# EasyEDA Pro project remo-v0.8.0-rc2-a.epro, board PCB5_6
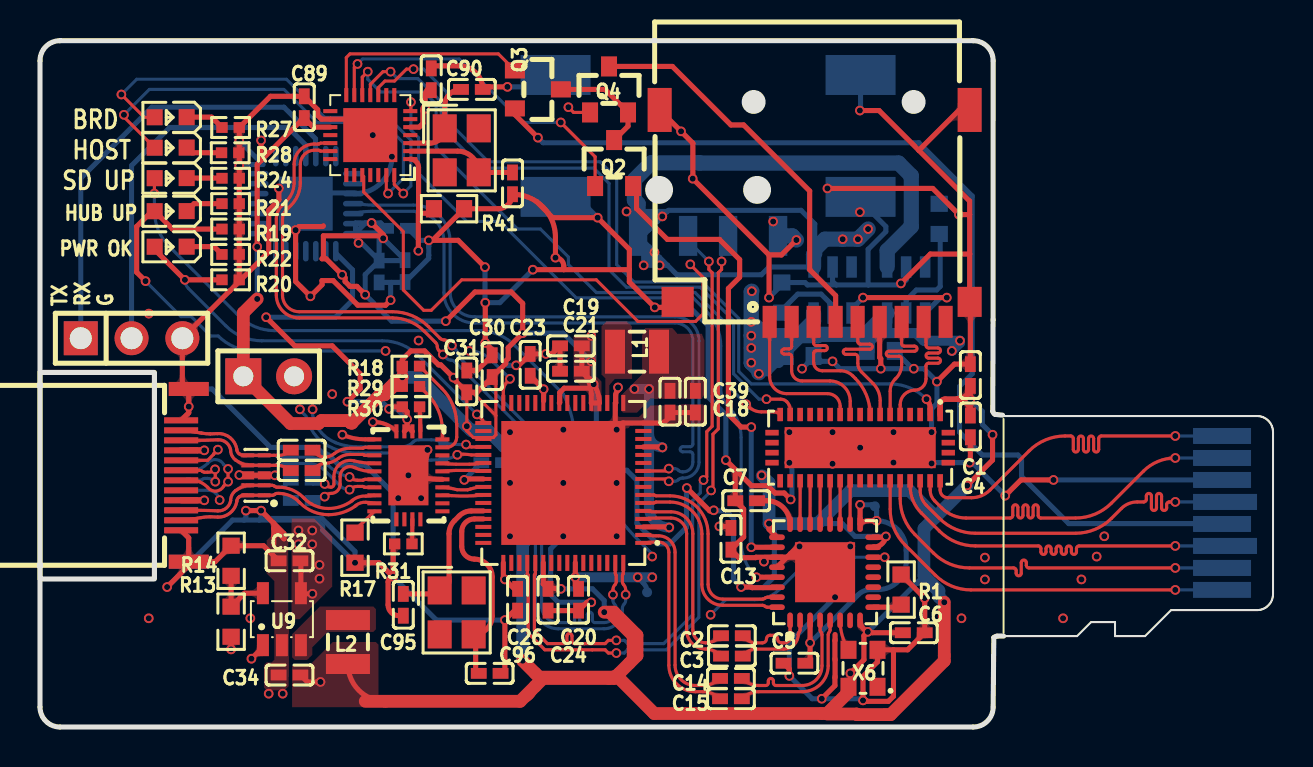
[diagram p3: board, top side]
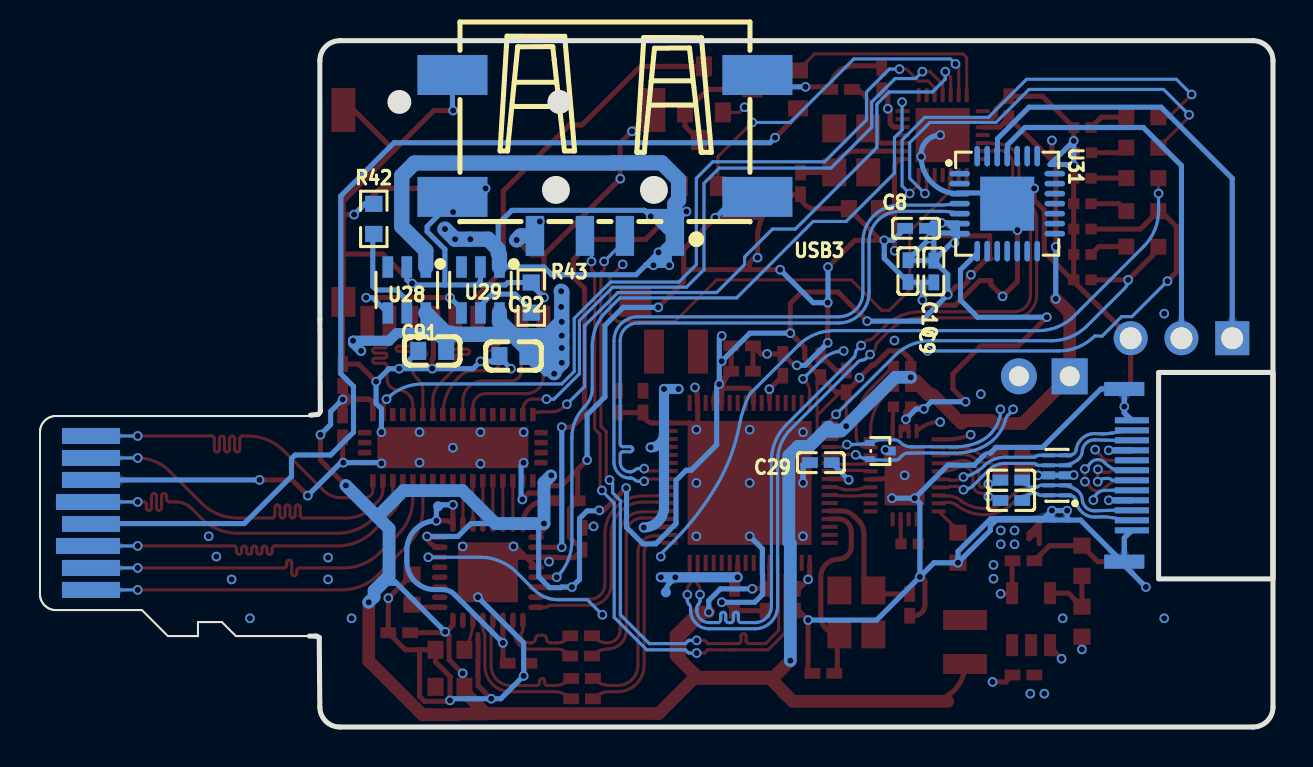
[diagram p4: board, bottom side, seen from below]

Outline 61.66 x 34.33 mm; copper layers: Top Layer, Inner1, Inner2, Bottom Layer. Coordinates in mm from the lower left corner of the outline.
Outline path: rectangle 0,17.74 5.72,7.41 ; 48.13,15.6 47.76,15.64 arc(47.68,15.71) 47.64,15.8 47.66,20.37 47.66,33.33 arc(47.37,34.04) 46.66,34.33 1,34.33 arc(0.29,34.04) 0,33.33 0,1 arc(0.29,0.29) 1,0 46.66,0 arc(47.37,0.29) 47.66,1 47.69,4.47 arc(47.78,4.53) 47.88,4.55 48.18,4.55
Stack: Top Layer 0.035mm 外层铜厚1oz / Dielectric1 0.2104mm 7628 RC49% 8.6mil / Inner1 0.0152mm 内层铜厚 / Dielectric2 1.065mm 1.1mm H/HOZ Copper / Inner2 0.0152mm 内层铜厚 / Dielectric3 0.2104mm 7628 RC49% 8.6mil / Bottom Layer 0.035mm 外层铜厚1oz

## Design rules (mm)
net $1N466: DP1
net RD_TX+: RD_TX
net $1N465: DP1
net RD_TX-: RD_TX
net RD_RX+: RD_RX
net RD_RX-: RD_RX
net UP_D-: UP_D
net UP_D+: UP_D
net UP_RX-: UP_RX
net UP_RX+: UP_RX
net UP_TX+: UP_TX
net UP_TX-: UP_TX
net $1N16323: DP4
net $1N16329: DP4
net UP_TX2-: UP_TX2
net UP_RX2+: UP_RX2
net UP_TX2+: UP_TX2
net UP_RX2-: UP_RX2
net UP_TX1+: UP_TX1
net $2N1220: DP5
net UP_TX1-: UP_TX1
net $2N1225: DP5
net $2N1216: DP6
net UP_RX1-: UP_RX1
net UP_RX1+: UP_RX1
net RD_D+: DP7
net SER_D+: SER_D
net SER_D-: SER_D
net HS_D+: DP9
net $2N4733: DP6
net RD_D-: DP7
net HS_D-: DP9
net BRD_D-: DP10
net BRD_D+: DP10
template: 自定义配置
spacing copperThickness1oz (default): track to track 0.102, other pairs 0.152 to 0.3
spacing copperThickness2oz: track to track 0.203, other pairs 0.152 to 0.3
track width copperThickness1oz (default): min 0.127, default 0.254, max 2.54
track width copperThickness2oz: min 0.203, default 0.254, max 2.54
track width TFP: min 0.157, default 0.157, max 0.157
differential pair differentialPair (default): width min 0.127, default 0.157, max 2.54; gap min 0.152, default 0.152
differential pair differentialPair3.0: width min 0.127, default 0.157, max 2.54; gap min 0.152, default 0.152
differential pair differentialPair4: width min 0.127, default 0.157, max 2.54; gap min 0.152, default 0.152
via viaSize (default): diameter min 0.483, default 0.483, max 10; hole min 0.3, default 0.305, max 6.299
net TS_DAT1 uses MUX_DUT, TFP
net TS_CLK uses MUX_DUT, TFP
net TS_DAT0 uses MUX_DUT, TFP
net TS_DAT3 uses MUX_DUT, TFP
net TS_DAT2 uses MUX_DUT, TFP
net TS_CMD uses MUX_DUT, TFP
net TF_DAT1 uses TFP, TF_MUX
net TF_DAT0 uses TFP, TF_MUX
net TF_CLK uses TFP, TF_MUX
net TF_CMD uses TFP, TF_MUX
net TF_DAT3 uses TFP, TF_MUX
net TF_DAT2 uses TFP, TF_MUX
net UP_DAT2 uses MUX_TS, TFP
net UP_DAT3 uses MUX_TS, TFP
net UP_CMD uses MUX_TS, TFP
net UP_CLK uses MUX_TS, TFP
net UP_DAT0 uses MUX_TS, TFP
net UP_DAT1 uses MUX_TS, TFP
diff pair DP1 uses differentialPair3.0
diff pair RD_TX uses differentialPair3.0
diff pair RD_RX uses differentialPair3.0
diff pair UP_D uses differentialPair4
diff pair UP_RX uses differentialPair3.0
diff pair UP_TX uses differentialPair3.0
diff pair DP4 uses differentialPair3.0

## Placement (name value [footprint] x y rotation side)
C1  100nF  [C0402]  46.52 15.04 90 top
C2  100nF  [C0402]  34.6 4.56 0 top
C3  100nF  [C0402]  34.6 3.55 0 top
C4  100nF  [C0402]  46.52 17.61 270 top
C5  100nF  [C0402]  37.72 3.19 0 top
C6  100nF  [C0402]  43.69 4.72 0 top
C7  100nF  [C0402]  35.31 11.32 180 top
C8  100nF  [C0402]  17.85 24.94 0 bottom
C9  100nF  [C0402]  18.25 22.81 90 bottom
C10  100nF  [C0402]  16.96 22.79 90 bottom
C13  100nF  [C0402]  34.55 9.42 270 top
C14  100nF  [C0402]  34.55 2.43 180 top
C15  100nF  [C0402]  34.55 1.41 180 top
C18  100nF  [C0402]  32.77 16.27 270 top
C19  10uF  [C0402]  26.55 17.8 0 top
C20  100nF  [C0402]  26.93 6.37 270 top
C21  100nF  [C0402]  26.55 19.07 0 top
C23  100nF  [C0402]  24.51 18.12 270 top
C24  100nF  [C0402]  25.41 6.37 270 top
C26  100nF  [C0402]  23.88 6.37 90 top
C29  100nF  [C0402]  22.61 13.22 180 bottom
C30  100nF  [C0402]  22.61 18.05 270 top
C31  100nF  [C0402]  21.34 17.29 270 top
C32  10uF  [C0402]  12.48 8.32 0 top
C34  10uF  [C0402]  12.48 2.6 180 top
C35  100nF  [C0402]  13.08 12.83 180 top
C36  100nF  [C0402]  13.08 13.85 180 top
C37  100nF  [C0402]  13.09 11.33 180 bottom
C38  100nF  [C0402]  13.09 12.35 180 bottom
C39  10uF  [C0402]  31.5 16.27 270 top
C89  0.1u  [C0402]  13.21 31 270 top
C90  0.1u  [C0402]  19.56 32.4 90 top
C91  10uF  [C0603]  42.04 18.81 0 bottom
C92  10uF  [C0603]  37.98 18.56 0 bottom
C93  20pF  [C0402]  21.6 31.89 180 top
C94  20pF  [C0402]  23.63 27.19 90 top
C95  20pF  [C0402]  18.17 6.11 90 top
C96  20pF  [C0402]  22.49 2.68 180 top
CARD1  TF PUSH  [TF-SMD_TF-PUSH]  38.74 25.57 180 top
H2  -  [HDR-TH_3P-P2.54-V-M]  4.58 19.45 0 top
H3  -  [HDR-TH_2P-P2.54-V-M-1]  11.44 17.54 0 top
L1  2.2uH  [IND-SMD_L2.5-W2.0_MHCHL2520]  29.85 18.78 0 top
L2  2.2uH  [IND-SMD_L2.5-W2.0_MHCHL2520]  15.4 4.25 90 top
LED5  -  [LED_0603]  6.48 30.5 180 top
LED6  -  [LED_0603]  6.48 28.97 180 top
LED7  -  [LED_0603]  6.48 25.8 180 top
LED8  -  [LED_0603]  6.48 24.02 180 top
LED9  -  [LED_0603]  6.48 27.45 180 top
Q2  AO3401A  [SOT-23_L2.9-W1.3-P1.90-LS2.4-BR]  28.71 28.21 270 top
Q3  AO3401A  [SOT-23_L2.9-W1.3-P1.90-LS2.4-BR]  24.9 31.89 180 top
Q4  AO3401A  [SOT-23_L2.9-W1.3-P1.90-LS2.4-BR]  28.45 31.89 270 top
R1  680  [R0603]  43.06 6.88 270 top
R13  68K  [R0603]  9.56 5.27 90 top
R14  15K  [R0603]  9.56 8.32 90 top
R17  20.5K  [R0603]  15.75 8.97 270 top
R18  10K  [R0402]  18.55 18.05 0 top
R19  10K  [R0402]  9.53 24.91 180 top
R20  10K  [R0402]  9.53 22.37 180 top
R21  1K  [R0402]  9.53 26.18 180 top
R22  1K  [R0402]  9.53 23.64 180 top
R24  1K  [R0402]  9.53 27.45 0 top
R27  1K  [R0402]  9.53 29.99 0 top
R28  1K  [R0402]  9.51 28.73 0 top
R29  10K  [R0402]  18.55 17.03 0 top
R30  10K  [R0402]  18.55 16.02 0 top
R31  10K  [R0402]  18.17 9.16 180 top
R41  10K  [R0603]  20.45 25.92 0 top
R42  22K  [R0603]  44.96 25.42 270 bottom
R43  22K  [R0603]  37.09 21.48 270 bottom
TP1  -  [Test-Point-0.5mm]  41.75 11.04 0 top
TP2  -  [Test-Point-0.5mm]  30.36 6.74 90 top
U1  TF卡插头  [TF卡封装]  59.18 10.71 180 top
U2  TS3DV642A0RUAR  [WFQFN-42_L9.0-W3.5-P0.50-BL-EP]  41.01 13.97 180 top
U3  GL3224-OIY04  [HQFN-32_L5.0-W5.0-P0.50-BL-EP3.0]  39.26 7.74 0 top
U6  CH634W6G  [QFN-64_L8.0-W8.0-P0.40-TL-EP6.2]  26.17 12.21 180 top
U7  TPD4EUSB30DQAR-N  [DFN-10_L2.5-W1.0-P0.50-BL-A]  10.8 12.59 90 bottom
U8  TPD2EUSB30DRTR-N  [SOT-723_L1.2-W0.8-P0.40-LS1.2-BR]  19.64 13.8 0 bottom
U9  TLV62569DBVR  [SOT-23-5_L3.0-W1.7-P0.95-LS2.8-BR]  12.1 5.39 270 top
U10  TPD4EUSB30DQAR-N  [DFN-10_L2.5-W1.0-P0.50-BL-A]  10.8 12.59 90 top
U11  VL160  [MQFN-28_L4.5-W3.5-P0.40-BL-EP]  18.42 12.59 270 top
U27  CH32V203G6U6  [QFN-28_L4.0-W4.0-P0.40-BL-EP2.7]  16.52 29.61 90 top
U28  CH217K  [SOT-23-6_L2.9-W1.6-P0.95-LS2.8-BL]  43.31 21.86 0 bottom
U29  CH217K  [SOT-23-6_L2.9-W1.6-P0.95-LS2.8-BL]  39.63 21.86 0 bottom
U31  CH9102X  [TQFN-28_L5.0-W5.0-P0.50-BL-EP2.7]  13.29 26.18 270 bottom
USB1  MC-233J08H93  [USB-C-SMD_TYPE-C-31-M-20]  7.25 12.59 270 top
USB3  10.0 QTJ6.3  [USB-A-SMD_10.0-QTJ6.3]  33.41 28.59 0 bottom
X6  25MHz  [OSC-SMD_4P-L2.5-W2.0-BL-1]  41.15 2.94 90 top
X7  24MHz  [CRYSTAL-SMD_4P-L3.2-W2.5-BL]  21.09 28.85 270 top
X8  24MHz  [CRYSTAL-SMD_4P-L3.2-W2.5-BL]  20.83 5.73 270 top

## Footprints (pads in the part's own frame, mm; a bottom-side part is the same pattern mirrored in y, then rotated)
C0402
  rect 0.79x0.54 smd: 1(-0.545,0) 2(0.545,0)
C0603
  rect 0.8x0.9 smd: 1(-0.7,0) 2(0.7,0)
CRYSTAL-SMD_4P-L3.2-W2.5-BL
  rect 1.4x1.2 smd: 1(-1.1,-0.85) 2(1.1,-0.85) 3(1.1,0.85) 4(-1.1,0.85)
DFN-10_L2.5-W1.0-P0.50-BL-A
  rect 0.2x0.633 smd: 1(-1,-0.411) 2(-0.5,-0.411) 4(0.5,-0.411) 5(1,-0.411) 6(1,0.411) 7(0.5,0.411) 9(-0.5,0.411) 10(-1,0.411)
  rect 0.4x0.633 smd: 3(0,-0.411) 8(0,0.411)
HDR-TH_2P-P2.54-V-M-1
  rect 1.8x1.8 hole 1: 1(-1.27,0)
  round 1.8 hole 1: 2(1.27,0)
HDR-TH_3P-P2.54-V-M
  rect 1.7x1.7 hole 1.1: 1(-2.54,0)
  round 1.7 hole 1.1: 2(0,0) 3(2.54,0)
HQFN-32_L5.0-W5.0-P0.50-BL-EP3.0
  oval 0.28x0.785 smd: 1(-1.75,-2.408) 2(-1.25,-2.408) 3(-0.75,-2.408) 4(-0.25,-2.408) 5(0.25,-2.408) 6(0.75,-2.408) 7(1.25,-2.408) 8(1.75,-2.408) 17(1.75,2.408) 18(1.25,2.408) 19(0.75,2.408) 20(0.25,2.408) 21(-0.25,2.408) 22(-0.75,2.408) 23(-1.25,2.408) 24(-1.75,2.408)
  oval 0.785x0.28 smd: 9(2.408,-1.75) 10(2.408,-1.25) 11(2.408,-0.75) 12(2.408,-0.25) 13(2.408,0.25) 14(2.408,0.75) 15(2.408,1.25) 16(2.408,1.75) 25(-2.408,1.75) 26(-2.408,1.25) 27(-2.408,0.75) 28(-2.408,0.25) 29(-2.408,-0.25) 30(-2.408,-0.75) 31(-2.408,-1.25) 32(-2.408,-1.75)
  rect 3x3 smd: 33(0,0)
IND-SMD_L2.5-W2.0_MHCHL2520
  rect 1x2.2 smd: 1(-1.1,0) 2(1.1,0)
LED_0603
  rect 0.8x0.8 smd: 1(-0.851,-0.01) 2(0.75,-0.005)
MQFN-28_L4.5-W3.5-P0.40-BL-EP
  rect 0.2x0.7 smd: 1(-1.8,-1.7) 2(-1.4,-1.7) 3(-1,-1.7) 4(-0.6,-1.7) 5(-0.2,-1.7) 6(0.2,-1.7) 7(0.6,-1.7) 8(1,-1.7) 9(1.4,-1.7) 10(1.8,-1.7) 15(1.8,1.7) 16(1.4,1.7) 17(1,1.7) 18(0.6,1.7) 19(0.2,1.7) 20(-0.2,1.7) 21(-0.6,1.7) 22(-1,1.7) 23(-1.4,1.7) 24(-1.8,1.7)
  rect 0.7x0.2 smd: 11(2.2,-0.6) 12(2.2,-0.2) 13(2.2,0.2) 14(2.2,0.6) 25(-2.2,0.6) 26(-2.2,0.2) 27(-2.2,-0.2) 28(-2.2,-0.6)
  rect 3x2 smd: 29(0,0)
OSC-SMD_4P-L2.5-W2.0-BL-1
  rect 0.9x0.8 smd: 1(-0.925,-0.725) 2(0.925,-0.725) 3(0.925,0.725) 4(-0.925,0.725)
QFN-28_L4.0-W4.0-P0.40-BL-EP2.7
  rect 0.2x0.7 smd: 1(-1.2,-2) 2(-0.8,-2) 3(-0.4,-2) 4(-0.001,-2) 5(0.4,-2) 6(0.8,-2) 7(1.2,-2) 15(1.2,2) 16(0.8,2) 17(0.4,2) 18(0,2) 19(-0.4,2) 20(-0.8,2) 21(-1.2,2)
  rect 0.7x0.2 smd: 8(2,-1.2) 9(2,-0.8) 10(2,-0.4) 11(1.999,0) 12(2,0.4) 13(2,0.8) 14(2,1.2) 22(-2,1.2) 23(-2,0.8) 24(-2,0.4) 25(-2,0) 26(-2,-0.4) 27(-2,-0.8) 28(-2,-1.2)
  rect 2.7x2.7 smd: 29(0.001,0)
QFN-64_L8.0-W8.0-P0.40-TL-EP6.2
  rect 0.8x0.2 smd: 1(-4,3) 2(-4,2.6) 3(-4,2.2) 4(-4,1.8) 5(-4,1.4) 6(-4,1) 7(-4,0.6) 8(-4,0.2) 9(-4,-0.2) 10(-4,-0.6) 11(-4,-1) 12(-4,-1.4) 13(-4,-1.8) 14(-4,-2.2) 15(-4,-2.6) 16(-4,-3) 33(4,-3) 34(4,-2.6) 35(4,-2.2) 36(4,-1.8) 37(4,-1.4) 38(4,-1) 39(4,-0.6) 40(4,-0.2) 41(4,0.2) 42(4,0.6) 43(4,1) 44(4,1.4) 45(4,1.8) 46(4,2.2) 47(4,2.6) 48(4,3)
  rect 0.2x0.8 smd: 17(-3,-4) 18(-2.6,-4) 19(-2.2,-4) 20(-1.8,-4) 21(-1.4,-4) 22(-1,-4) 23(-0.6,-4) 24(-0.2,-4) 25(0.2,-4) 26(0.6,-4) 27(1,-4) 28(1.4,-4) 29(1.8,-4) 30(2.2,-4) 31(2.6,-4) 32(3,-4) 49(3,4) 50(2.6,4) 51(2.2,4) 52(1.8,4) 53(1.4,4) 54(1,4) 55(0.6,4) 56(0.2,4) 57(-0.2,4) 58(-0.6,4) 59(-1,4) 60(-1.4,4) 61(-1.8,4) 62(-2.2,4) 63(-2.6,4) 64(-3,4)
  rect 6.2x6.2 smd: 65(0,0)
R0402
  rect 0.566x0.54 smd: 1(-0.433,0) 2(0.433,0)
R0603
  rect 0.806x0.864 smd: 1(-0.753,0) 2(0.753,0)
SOT-23-5_L3.0-W1.7-P0.95-LS2.8-BR
  rect 1.1x0.6 smd: 1(1.3,-0.95) 2(1.3,0) 3(1.3,0.95) 4(-1.3,0.95) 5(-1.3,-0.95)
SOT-23-6_L2.9-W1.6-P0.95-LS2.8-BL
  rect 0.532x1.072 smd: 1(-0.95,-1.149) 2(0,-1.149) 3(0.95,-1.149) 4(0.95,1.149) 5(0,1.149) 6(-0.95,1.149)
SOT-23_L2.9-W1.3-P1.90-LS2.4-BR
  rect 1x0.8 smd: 1(1.15,-0.95) 2(1.15,0.95) 3(-1.15,0)
SOT-723_L1.2-W0.8-P0.40-LS1.2-BR
  rect 0.489x0.294 smd: 1(0.529,-0.4) 2(0.529,0.4)
  rect 0.489x0.434 smd: 3(-0.529,0)
Test-Point-0.5mm
  round 0.5 smd far side: 1(0,0)
TF-SMD_TF-PUSH
  rect 0.7x1.6 smd: 1(2.25,5.3) 2(1.15,5.3) 3(0.05,5.3) 4(-1.05,5.3) 5(-2.15,5.3) 6(-3.25,5.3) 7(-4.35,5.3) 8(-5.45,5.3) CD(-6.55,5.3)
  rect 1.2x1.5 smd: 10(-7.75,4.3)
  rect 1.2x2.2 smd: 11(-7.75,-5.3) 12(7.75,-5.3)
  rect 1.6x1.5 smd: 13(6.85,4.3)
TF卡封装
  rect 2.9x0.8 smd far side: 1(0.075,3.85) 2(0.074,2.751) 4(0.075,0.551) 6(0.074,-1.651) 7(0.074,-2.751) 8(0.074,-3.85)
  rect 3.2x0.8 smd far side: 3(-0.074,1.65) 5(-0.075,-0.551)
TQFN-28_L5.0-W5.0-P0.50-BL-EP2.7
  oval 0.28x1.03 smd: 1(-1.5,-2.377) 2(-1,-2.377) 3(-0.5,-2.377) 4(0,-2.377) 5(0.5,-2.377) 6(1,-2.377) 7(1.5,-2.377) 15(1.5,2.377) 16(1,2.377) 17(0.5,2.377) 18(0,2.377) 19(-0.5,2.377) 20(-1,2.377) 21(-1.5,2.377)
  oval 1.03x0.28 smd: 8(2.377,-1.5) 9(2.377,-1) 10(2.377,-0.5) 11(2.377,0) 12(2.377,0.5) 13(2.377,1) 14(2.377,1.5) 22(-2.377,1.5) 23(-2.377,1) 24(-2.377,0.5) 25(-2.377,0) 26(-2.377,-0.5) 27(-2.377,-1) 28(-2.377,-1.5)
  rect 2.7x2.7 smd: 29(0,0)
USB-A-SMD_10.0-QTJ6.3
  rect 0.92x2 smd: 1(-3.5,4.025) 2(-1,4.025) 3(1,4.025) 4(3.5,4.025)
  rect 3.5x2 smd: 5(7.625,2.075) 6(7.625,-4.025) 7(-7.625,-4.025) 8(-7.625,2.075)
USB-C-SMD_TYPE-C-31-M-20
  rect 0.7x2 smd: 25(-4.32,0.192) 25(4.32,0.192)
  rect 0.7x2 smd far side: 25(-4.32,0.192) 25(4.32,0.192)
  rect 0.3x1.7 smd: A1(-2.75,-0.188) A2(-2.25,-0.188) A3(-1.75,-0.188) A4(-1.25,-0.188) A5(-0.75,-0.188) A6(-0.25,-0.188) A7(0.25,-0.188) A8(0.75,-0.188) A9(1.25,-0.188) A10(1.75,-0.188) A11(2.25,-0.188) A12(2.75,-0.188)
  rect 0.3x1.7 smd far side: B1(2.75,-0.188) B2(2.25,-0.188) B3(1.75,-0.188) B4(1.25,-0.188) B5(0.75,-0.188) B6(0.25,-0.188) B7(-0.254,-0.192) B8(-0.75,-0.188) B9(-1.25,-0.188) B10(-1.75,-0.188) B11(-2.25,-0.188) B12(-2.75,-0.188)
WFQFN-42_L9.0-W3.5-P0.50-BL-EP
  rect 0.28x0.665 smd: 1(-3.998,-1.657) 2(-3.498,-1.657) 3(-2.998,-1.657) 4(-2.498,-1.657) 5(-1.998,-1.657) 6(-1.498,-1.657) 7(-0.998,-1.657) 8(-0.497,-1.657) 9(0.003,-1.657) 10(0.502,-1.657) 11(1.002,-1.657) 12(1.502,-1.657) 13(2.002,-1.657) 14(2.502,-1.657) 15(3.002,-1.657) 16(3.502,-1.657) 17(4.003,-1.657) 22(4.003,1.657) 23(3.502,1.657) 24(3.002,1.657) 25(2.502,1.657) 26(2.002,1.657) 27(1.502,1.657) 28(1.002,1.657) 29(0.502,1.657) 30(0.003,1.657) 31(-0.497,1.657) 32(-0.998,1.657) 33(-1.498,1.657) 34(-1.998,1.657) 35(-2.498,1.657) 36(-2.998,1.657) 37(-3.498,1.657) 38(-3.998,1.657)
  rect 0.665x0.28 smd: 18(4.41,-0.75) 19(4.41,-0.25) 20(4.41,0.25) 21(4.41,0.75) 39(-4.405,0.75) 40(-4.405,0.25) 41(-4.405,-0.25) 42(-4.405,-0.75)
  rect 7.55x2.05 smd: 43(0.003,0)

## Nets
As in the schematic.

Pads without a net: CARD1 CD; U2 3 4 9 12 13 14 15 18 19 20 21 22 23 30 31 32 39 40 41 42; U3 7; U6 8 11 12 14 15 22 23 24 26 28 29 30 31 34 43 46 47 48 50 51 55 56 57 59 60 61 62; U11 11 12 14 15 16 22; U27 4 6 15 18 21 22 23 25 26; U28 3; U29 3; U31 1 2 9 10 11 12 13 14 15 16 17 18 19 20 21 22 23 24 27 28; USB1 A8 B8; X6 1; X7 2 4; X8 2 4

## Via types
v1: diameter 0.482, hole 0.305, Top Layer to Bottom Layer, 239 vias

## Routing (per net, layer and track width the routed paths; a pad name or vN(x,y) marks a point on that pad's centre or on a via; arc(x,y) is an arc through that point)
+5V: length 136.9
  Top Layer w0.254: 18.36,15.05 18.36,14.93 U11.27 ; 18.36,15.05 U11.26 ; 18.36,15.05 v1(18.36,15.39) 18.36,15.78 R30.1 17.56,16.02 v1(17.45,15.91) ; v1(13.62,6.67) 13.08,6.67 U9.4 13.05,8.29 C32.2 ; v1(11.31,20.5) 12.74,19.07 14.61,19.07 16.01,17.67 16.01,16.91 v1(15.37,16.27) ; U9.1 11.15,3.99 v1(10.57,3.42)
  Top Layer w0.305: USB1.A9 v1(8.21,11.34) ; USB1.A4 v1(8.21,13.84)
  Inner2 w0.254: 8.01,12.97 8.21,13.18 v1(8.21,13.84) ; v1(10.57,3.42) 13.62,6.47 v1(13.62,6.67)
  Inner2 w0.508: 14.71,19.42 14.44,19.7 9.91,19.7 8.39,18.18 8.39,16.15 8.9,15.64 9.4,15.64 9.8,15.24 14.34,15.24 v1(15.37,16.27) 17.09,16.27
  Inner2 w0.762: 8.9,15.64 7.5,14.24 7.5,13.73 ; v1(35.6,21.8) v1(35.6,21.02) 35.6,18.25 v1(35.57,18.22) ; 18.09,15.66 v1(18.36,15.39) ; v1(17.45,15.91) 17.84,15.91
  Inner2 w1.524: 15.37,20.08 14.71,19.42 14.3,19 14.3,18.6 15.77,17.13 ; 15.37,20.08 15.63,19.83 15.63,17.8 ; 15.37,20.08 18.04,20.08 20.34,22.38 20.34,22.73 21.77,24.16 22.73,24.16 23.49,23.4 23.49,22.4 24.16,21.72 27.7,21.72 30.23,19.19 34.59,19.19 v1(35.57,18.22) ; v1(13.61,9.14) 14.81,9.14 16.63,10.96 16.63,13.61 17.8,14.78 17.8,15.27 17.91,15.38 ; 18.09,15.66 17.84,15.91 16.62,17.13 15.77,17.13 ; 15.77,17.13 15.77,16.17 15.68,16.09
  Bottom Layer w0.254: v1(11.31,20.5) 14.77,20.5 15.63,21.35 15.63,22.87 14.78,23.72 ; v1(35.95,17.67) 36.39,17.67 36.94,18.22 ; v1(15.37,16.27) 17.09,16.27 v1(17.45,15.91) 17.84,15.91 v1(18.36,15.39)
  Bottom Layer w0.305: USB1.A9 v1(8.21,11.34) ; USB1.A4 v1(8.21,13.84)
  Bottom Layer w0.508: v1(35.57,18.22) 36.5,18.22 ; 36.5,18.22 v1(35.95,17.67) ; 36.5,18.22 36.84,18.56 ; 36.5,18.22 36.94,18.22 C92.1 ; 41.9,19.7 41.35,19.7 ; 41.9,19.7 42.27,19.7 ; 41.9,19.7 41.34,19.14 ; v1(45.6,18.81) 46,19.22 v1(46,19.32) 44.2,19.32 43.82,19.7 42.27,19.7 ; 42.27,19.7 42.36,19.79 U28.6
  Bottom Layer w0.762: 37.27,18.56 36.58,18.56 ; 37.27,18.56 36.26,19.58 ; 37.27,18.56 C92.1 ; 36.26,19.58 37.96,19.58 ; 36.26,19.58 v1(35.57,20.27) ; 36.26,19.58 v1(35.57,19.58) ; 37.96,19.58 38.1,19.71 ; 37.96,19.58 38.87,19.58 38.94,19.64 ; 37.96,19.58 37.28,18.89 37.28,18.69 ; v1(35.57,18.22) v1(35.57,18.96) v1(35.57,19.58) ; v1(35.57,18.22) 35.6,18.25 35.9,18.56 36.58,18.56 ; v1(35.57,18.22) 35.95,17.84 35.95,17.72 ; v1(35.6,21.8) 35.57,21.77 v1(35.57,20.27) ; 38.1,19.71 38.68,20.29 U29.6 ; 38.1,19.71 38.16,19.64 38.94,19.64 ; v1(35.57,20.27) v1(35.57,19.58) ; v1(35.57,19.58) 36.58,18.56 ; C91.1 41.34,19.69 ; 41.34,19.69 41.12,19.69 41.07,19.64 38.94,19.64 ; 41.34,19.69 41.35,19.7 U28.6
  vias: v1(12.92,9.83) v1(12.92,9.14) v1(13.61,9.83) v1(13.98,8.11) v1(13.98,7.42)
GND: length 360.1
  Top Layer w0.254: 11.69,10.19 v1(11.06,10.82) v1(10.29,10.82) ; 11.69,10.19 12.2,9.68 12.2,9.42 11.9,9.72 ; 11.69,10.19 11.69,9.92 ; v1(17.66,7.51) 16.95,8.22 v1(15.75,8.22) ; v1(17.66,7.51) 17.66,9.09 R31.2 ; v1(17.66,7.51) arc(17.48,7.44) 17.41,7.26 17.41,6.11 arc(17.56,5.73) 17.95,5.57 C95.1 ; v1(6.36,7) 7.44,8.08 USB1.25 ; 34.77,12.88 C7.2 35.19,10.9 35.19,9.5 C13.2 34.95,8.47 35.78,8.47 35.8,8.49 U3.27 37.35,8.49 ; 34.77,12.88 v1(34.3,13.35) ; 34.77,12.88 35.58,12.07 36.39,12.07 36.76,11.7 37.21,11.7 v1(37.54,11.38) ; 46.49,25.65 46.49,26.31 43.95,28.85 ; 46.49,25.65 46.47,25.63 v1(45.95,25.63) 44.64,26.94 v1(39.38,26.94) ; 46.49,25.65 46.49,23.66 ; 11.69,9.55 11.69,9.92 ; 11.69,9.55 11.73,9.55 11.9,9.72 ; 11.69,9.55 11.69,9.16 ; 11.69,9.92 11.9,9.72 ; v1(48.27,11.57) 49.05,12.36 v1(50.68,12.36) ; R20.1 R22.1 R19.1 R21.1 R24.2 v1(9.96,28.08) v1(9.96,29.32) R27.2 11.52,31.55 C89.1 13.89,30.88 13.89,30.59 14.07,30.41 U27.16 15.72,30.41 arc(16.28,30.17) 16.52,29.61 ; R20.1 10.04,22.37 11.44,23.77 11.44,25.85 11.94,26.36 v1(11.94,26.94) ; R20.1 9.96,22.29 9.5,21.82 9.49,21.82 H2.3 7.12,17.23 USB1.25 v1(7.44,16.03) 7.44,15.72 USB1.A1 ; 36.45,23.61 37.08,23.61 v1(37.82,24.36) ; 36.45,23.61 v1(36.45,21.48) ; 36.45,23.61 v1(32.64,27.43) ; C24.2 C20.2 27.35,6.24 v1(27.56,6.24) ; 29.47,22.88 29.47,22.26 v1(30.74,20.99) 31.61,20.99 CARD1.13 ; 29.47,22.88 26.19,22.88 ; 29.47,22.88 29.47,23.89 v1(27.88,25.48) 25.64,25.48 25.4,25.71 ; 37.35,8.49 37.53,8.67 ; 37.35,8.49 U3.28 ; 37.35,8.49 38.51,8.49 ; 37.53,8.67 38.33,8.67 38.51,8.49 ; 37.53,8.67 37.89,9.03 v1(37.98,9.03) ; 39.76,4.63 39.76,4.38 arc(39.75,4.35) 39.75,4.31 39.75,3.41 arc(39.75,3.38) 39.76,3.35 39.76,2.53 arc(39.75,2.5) 39.75,2.46 39.75,2.07 v1(39.09,1.41) ; 43.95,28.85 45.97,30.87 CARD1.11 ; 43.95,28.85 41.96,30.84 v1(41,30.84) ; C19.1 C21.1 25.6,18.66 v1(25.3,18.66) C23.1 23.94,18.09 v1(23.81,18.09) ; USB1.A12 7.44,9.46 USB1.25 ; 19.56,33.07 20.96,33.07 arc(21.8,32.73) C93.1 22.27,32.02 v1(23.37,32.02) ; USB1.25 8.76,8.27 R14.2 11.18,9.07 C32.1 ; v1(46.49,13.22) 46.52,13.26 C1.1 ; 26.19,22.88 v1(24.64,22.88) ; 26.19,22.88 26.19,23.06 arc(26.07,23.36) v1(25.77,23.48) 25.77,24.5 arc(25.68,25.14) 25.4,25.71 ; 25.4,25.71 24.84,26.28 ; 25.4,25.71 arc(25.15,26.02) 24.84,26.28 ; 24.84,26.28 arc(24.26,26.55) 23.63,26.65 arc(23.42,26.14) 22.9,25.92 R41.2 19.63,24.34 ; CARD1.6 41.99,18.49 42.04,18.43 v1(42.04,17.92) ; v1(11.75,12.59) U10.3 U10.8 ; CARD1.12 v1(32.06,29.8) 32.65,29.21 32.65,27.45 ; 46.49,23.66 CARD1.10 46.52,21.23 C4.1 45.73,18.15 v1(44.85,17.28) ; 46.49,23.66 44.52,23.66 v1(43.05,22.19) ; 19.63,24.34 v1(19.44,24.34) ; 19.63,24.34 20.91,24.34 v1(22.25,23) ; 38.51,8.49 U3.33 ; v1(22.27,21.23) v1(22.27,19.22) 22.61,18.87 C30.1 21.85,17.83 C31.1 ; v1(37.47,2.56) 37.47,2.9 C5.1 ; 14.17,25.07 14.13,25.04 12.96,25.04 v1(12.78,24.86) 12.78,22.28 v1(13.52,21.54) 14.1,22.12 14.1,22.33 14.66,22.33 15.89,21.1 17.28,21.1 v1(17.53,21.35) ; 42.69,3.86 X6.2 41.88,3.26 41.13,2.51 41.15,2.48 v1(41.15,1.33) 41.32,1.33 41.36,1.28 42.42,1.28 42.68,1.54 42.68,3.85 42.69,3.86 ; 42.69,3.86 43.39,3.86 C6.2 v1(44.24,6.45) 43.06,7.63 ; v1(28.9,16.99) 28.9,16.84 28.86,16.8 arc(28.81,16.71) 28.79,16.61 28.79,16.21 arc(28.78,16.21) U6.18 28.77,14.94 arc(28.79,14.9) v1(28.84,14.88) arc(28.93,15.11) 29.17,15.21 U6.16 30.98,15.21 arc(31.35,15.36) C39.2 C18.2 ; 23.72,5.82 v1(23.25,5.35) 23.25,2.83 arc(23.23,2.75) 23.19,2.68 ; v1(19.38,13.86) arc(19.11,13.07) v1(18.42,12.59) arc(19.27,12.44) U11.19
  Inner1 w0.254: 10.29,11.14 10.29,12.28 v1(9.97,12.61) ; 10.29,11.14 v1(11.75,12.59) ; 10.29,11.14 v1(10.29,10.82) v1(11.06,10.82)
  Bottom Layer w0.152: 13.78,26.72 13.78,27.1
  Bottom Layer w0.158: 14.18,13.7 14.34,13.7 14.44,13.61
  Bottom Layer w0.254: v1(41,30.84) 41.03,30.87 USB3.6 ; 43.63,17.92 v1(42.04,17.92) 40,17.92 v1(39.63,18.29) 39.07,18.29 38.68,18.69 38.68,18.5 v1(38.11,17.92) ; 43.63,17.92 v1(43.69,17.92) 44.2,17.92 v1(44.85,17.28) 44.85,16.18 44.58,15.92 v1(44.58,14.75) ; 43.63,17.92 C91.2 ; v1(22.27,19.22) 23.39,18.09 v1(23.81,18.09) ; U31.3 15.75,26.68 arc(17.05,27.22) v1(17.6,28.53) 17.6,28.65 arc(17.32,29.33) v1(16.64,29.61) ; 14.44,13.61 14.95,13.1 16.26,13.1 v1(17.91,11.45) ; 10.97,10.35 11.06,10.44 v1(11.06,10.82) ; 10.97,10.35 10.2,10.35 ; 10.97,10.35 13.83,10.35 14.13,10.05 14.13,9.83 v1(15.75,8.22) ; v1(6.36,7) 7.44,8.08 USB1.25 ; U1.6 v1(50.68,12.36) ; v1(11.06,10.82) 11.45,10.43 14.1,10.43 15.75,8.78 v1(15.75,8.22) ; v1(11.06,10.82) v1(10.29,10.82) 10.29,10.45 10.2,10.35 ; 39.81,22.11 38.38,22.11 38.26,22.23 R43.1 37.09,22.12 v1(36.45,21.48) ; 39.81,22.11 41.41,22.11 ; 39.81,22.11 39.63,22.29 U29.2 ; v1(17.66,7.51) 16.95,8.22 v1(15.75,8.22) ; v1(17.66,7.51) 19.82,5.35 v1(23.25,5.35) ; v1(17.66,7.51) 17.66,11.19 v1(17.91,11.45) ; U28.2 43.31,22.37 43.13,22.19 v1(43.05,22.19) 42.98,22.11 41.41,22.11 ; v1(45.95,25.63) 45.41,26.17 R42.1 ; v1(17.53,21.35) 17.53,22.21 17.56,22.24 ; 10.2,10.35 9.63,10.35 7.54,8.27 USB1.25 ; v1(48.27,11.57) 46.62,13.22 v1(46.49,13.22) 44.62,13.22 v1(44.58,13.19) ; v1(17.91,11.45) v1(19.06,11.45) ; v1(37.47,13.22) 37.6,13.09 37.6,11.32 ; v1(41,25.76) 41.57,25.76 42.3,25.04 42.3,24.78 41.41,23.89 41.41,22.11 ; v1(41.15,1.33) 41.07,1.41 v1(39.09,1.41) 38.61,1.41 v1(37.47,2.56) 37.47,4.21 v1(39.76,6.49) ; v1(27.88,25.48) 26.85,26.52 25.78,26.52 ; v1(22.25,23) 22.25,21.24 v1(22.27,21.23) 22.99,21.23 v1(24.64,22.88) ; USB1.25 7.44,9.46 USB1.A12 ; v1(27.56,6.24) 25.91,6.24 25.53,6.62 25.53,6.68 25.52,6.7 25.52,7.62 25.53,7.64 25.53,8.91 v1(26.17,9.54) ; 17.56,22.24 18.24,22.24 C9.1 19.44,23.44 19.44,23.61 19.44,23.61 19.44,24.04 19.44,24.04 19.44,24.34 v1(19.44,24.34) 18.99,24.34 C8.2 ; 17.56,22.24 C10.1 ; v1(30.74,20.99) 32.5,20.99 33.41,20.08 33.41,16.51 34.3,15.62 v1(34.3,13.35) ; 13.28,26.22 13.78,26.72 15.78,26.72 ; U10.8 U10.3 v1(11.75,12.59) ; 25.78,32.62 25.19,32.02 v1(23.37,32.02) ; 14.18,13.7 14.13,13.7 13.85,13.99 11.53,13.99 8.6,16.91 USB1.25 v1(7.44,16.03) 7.44,15.72 USB1.A1 ; v1(23.5,12.21) 23.5,13.14 23.41,13.22 ; v1(9.96,29.32) 11.15,28.14 10.29,28.14 10.24,28.08 v1(9.96,28.08) v1(9.96,29.32)
  Bottom Layer w0.762: v1(37.82,24.36) 37.62,24.57 USB3.4
  vias: v1(5.44,20.68) v1(5.44,5.44) v1(10.52,5.44) v1(11.44,1.67) v1(12.14,1.67) v1(14.61,16.65) v1(18.93,19.33) v1(23.5,14.75) v1(23.5,9.54) v1(26.17,14.88) v1(26.17,12.21) v1(28.83,12.21) v1(28.84,9.54) v1(36.2,8.27) v1(36.66,25.29) v1(37.47,14.75) v1(39.63,14.75) v1(39.63,13.17) v1(40.52,9.03) v1(41.01,13.97) v1(42.68,14.75) v1(42.68,13.23) v1(46.08,5.44) v1(47.25,8.48) v1(47.25,7.38) v1(51.16,5.44) v1(52.08,7.38) v1(52.84,8.53) v1(53.22,9.54)
VCC: length 271.7
  Top Layer w0.152: 22.24,14.48 22.66,14.48 22.8,14.61 22.8,15.58 ; 22.24,14.48 22.1,14.48 ; 22.24,14.48 U6.35 22.1,14.48 ; 22.1,14.48 21.67,14.48 21.34,14.81 v1(21.34,15.05) C31.2 ; 22.8,15.58 21.63,16.74 ; 22.8,15.58 22.8,17.32 C30.2
  Top Layer w0.254: U3.25 36.46,9.89 v1(36.46,10.18) ; X6.4 40.52,2.1 v1(40.52,2.68) 41.2,3.36 41.2,4.57 v1(41.39,4.76) ; v1(47.63,14.62) 47.63,13.35 v1(46.36,12.08) ; v1(16.26,21.63) 15.85,22.04 15.5,22.04 15.26,22.29 15.26,22.47 v1(15.11,22.62) 14.31,23.42 14.1,23.42 14.17,23.49 14.17,24.57 17.03,24.57 v1(17.16,24.44) 17.16,24.63 v1(16.58,25.21) ; U3.30 36.83,6.97 35.6,6.97 35.57,7 v1(35.06,7) ; v1(20.29,20.3) 21.75,21.76 23.57,21.76 24.14,21.19 v1(24.14,19.7) 23.41,18.98 23.41,18.43 23.28,18.3 23.28,18.18 C30.2 21.85,16.74 C31.2 20.79,17.29 20.79,17.36 v1(20.68,17.48) 20.04,18.11 19.93,18.11 19.23,18.81 18.55,18.81 18.12,18.38 R18.1 ; C1.2 v1(46.52,16.39) ; U6.54 25.17,7.15 arc(25.59,6.96) v1(26.04,6.91) ; 11.06,28.34 10.86,28.14 v1(10.86,24.02) ; 11.06,28.34 13.18,30.46 C89.2 13.67,30.01 14.52,30.01 ; 11.06,28.34 v1(11.06,29.34) ; 29.47,3.19 29.47,4.49 v1(28.21,5.74) ; C19.2 27.46,17.43 arc(27.58,17.3) v1(27.69,17.15) arc(27.9,16.7) U6.20 U6.21 27.57,16.65 arc(27.56,16.8) 27.54,16.95 ; C19.2 C21.2 ; C19.2 arc(27.38,17.41) 27.54,16.95 ; 42.16,0.51 42.26,0.62 ; C6.1 41.63,4.72 arc(41.51,4.73) v1(41.39,4.76) ; 41.69,9.01 U3.15 arc(42.07,9.13) 42.29,9.49 ; 30.72,0.67 30.49,0.67 ; v1(46.52,16.39) 45.87,16.39 arc(45.86,16.39) 45.86,16.4 ; v1(46.52,16.39) C4.2 ; 39.09,0.67 39.07,0.65 ; R13.1 v1(9.56,3.88) ; 12.57,15.14 15.39,15.14 15.49,15.25 17.74,17.49 v1(18.12,17.49) ; v1(32.34,11.95) 33.49,10.81 33.66,10.81 ; U3.16 42.29,9.49 ; 42.29,9.49 42.3,9.49 ; 42.29,9.49 arc(42.29,9.51) v1(42.3,9.53) ; U6.25 25.99,16.23 25.99,16.72 26.21,16.95 27.54,16.95 ; 18.52,30.01 18.96,30.01 19.15,30.19 19.15,30.81 v1(19.26,30.93) 19.26,31.68 19.31,31.73 arc(19.38,31.91) 19.56,31.98 ; 28.96,2.68 24.77,2.68 24.77,2.05 arc(24.55,1.51) 24.01,1.29 ; C34.1 13.37,2.25 v1(14.02,2.25) ; v1(41.39,4.76) arc(41.11,4.99) U3.8 ; L2.1 arc(15.94,1.83) 17.26,1.29
  Top Layer w0.28: C1.2 46.52,15.74 arc(46.52,15.75) 46.52,15.76 arc(46.37,16.16) 46,16.39 arc(45.93,16.4) 45.86,16.4 ; 45.86,16.4 45.27,16.4 arc(45.09,16.33) 45.01,16.15 45.01,15.59 ; 45.86,16.4 arc(46.33,16.59) C4.2
  Top Layer w0.508: R18.1 v1(18.12,17.49) R29.1
  Top Layer w0.635: v1(18.12,17.49) 17.24,16.62 17,16.62 15.59,15.21 ; 25.15,2.43 25.03,2.43 v1(24.14,3.32) ; 25.15,2.43 28.45,2.43 ; 25.15,2.43 24.01,1.29 16.26,1.29 ; 39.36,0.65 40.83,0.65 40.86,0.62 42.53,0.62 45.22,3.31 v1(45.22,6.24) ; 15.59,15.21 15.53,15.21 15.41,15.33 14.08,15.33 13.93,15.18 12.53,15.18 H3.1 10.17,20.72 v1(10.86,21.41) ; 15.59,15.21 15.59,15.19 ; 28.84,2.56 30.72,0.67 39.36,0.67 40.43,1.75 X6.4 ; 28.84,2.56 28.71,2.43 28.45,2.43 ; 28.84,2.56 28.45,2.43 ; 28.84,2.56 29.85,3.57 29.85,4.59 28.69,5.74 v1(28.21,5.74)
  Inner2 w0.254: v1(14.02,2.25) 10.54,2.25 9.56,3.24 v1(9.56,3.88)
  Inner2 w0.635: v1(11.06,29.34) 11.06,29.35 12.07,30.37 18.7,30.37 v1(19.26,30.93)
  Bottom Layer w0.254: 15.78,24.71 16.89,24.71 16.96,24.65 ; 15.78,24.71 16.28,25.21 ; 15.78,24.71 15.78,25.21 16.28,25.21 ; 15.78,24.71 15.78,24.51 C10.2 ; C10.2 16.26,22.63 v1(16.26,21.63) 17.59,20.3 v1(20.29,20.3) ; C10.2 18.24,23.33 C9.2 v1(17.16,24.44) 16.98,24.62 ; C10.2 16.96,24.6 ; 16.28,25.21 v1(16.58,25.21) ; 44.79,10.51 44.62,10.68 ; 22.19,15.05 v1(21.34,15.05) ; 43.82,7.19 v1(41.39,4.76) ; 43.82,7.19 44.2,7.57 44.2,7.26 44.27,7.19 ; 43.82,7.19 44.27,7.19 ; v1(27.56,18.3) 26.16,19.7 v1(24.14,19.7) ; 16.96,24.6 16.96,24.65 ; 16.96,24.6 16.98,24.62 ; 16.96,24.65 16.98,24.62 ; 16.96,24.65 16.96,24.83 v1(16.58,25.21) ; 16.98,24.62 C8.1 17.03,25.21 v1(16.58,25.21) ; 44.27,7.19 44.95,6.51 ; v1(28.21,5.74) 28.21,6.33 27.63,6.91 v1(26.04,6.91) ; 22.43,14.81 21.58,14.81 21.79,14.6 22.63,14.6 ; v1(33.69,10.84) 33.72,10.81 34.3,10.81 34.68,10.43 34.68,7.38 v1(35.06,7) 35.57,7 35.6,6.97 36.17,6.97 36.72,7.52 36.72,9.91 v1(36.46,10.18) ; v1(42.3,9.53) 40.75,9.53 40.11,10.18 38.89,10.18 ; v1(32.34,11.95) 32.33,11.94 32.33,9.99 31.5,9.16 30.87,9.16 29.85,10.18 29.85,12.34 29.34,12.84 29.09,12.84 27.82,14.11 27.82,17.02 v1(27.69,17.15) 27.69,19.44 v1(27.56,19.57) ; v1(46.52,16.39) 47.12,15.79 47.12,15.13 v1(47.63,14.62) ; 23.37,13.86 23.2,14.04 ; v1(10.86,21.41) v1(10.86,24.02)
  Bottom Layer w0.635: v1(45.22,6.24) 44.95,6.51 44.95,6.82 44.2,7.57 44.2,9.92 v1(46.36,12.08) ; 36.11,12.56 36.46,12.22 v1(36.46,10.18) 38.89,10.18 40.54,11.83 43.47,11.83 44.62,10.68 ; 22.23,15.01 23.2,14.04 23.74,14.04 24.21,13.57 24.21,9.25 24.14,9.17 v1(24.14,3.32) ; 21.58,14.81 v1(21.34,15.05) 18.9,17.49 v1(18.12,17.49)
  vias: v1(15.93,24.22) v1(36.09,12.59)
25CLKIN: length 1.6
  Top Layer w0.158: U3.6 arc(40.12,4.57) X6.3
BOOT0: length 14.9
  Top Layer w0.254: 18.93,25.7 18.92,25.69 v1(18.92,23.82) ; 18.93,25.7 19.47,25.7 R41.1 19.44,25.92 ; 18.93,25.7 18.93,28 arc(18.81,28.29) U27.1
  Inner1 w0.254: H3.2 12.91,17.54 16.78,21.41 16.78,21.69 v1(18.92,23.82)
BRD_D+: length 32.7
  Top Layer w0.158: v1(28.82,3.7) 28.42,3.7 28.26,3.86 27.62,3.86 27.62,3.86 27.09,3.86 27.09,3.86 25.24,3.86 24.41,4.69 24.41,7.61 24.37,7.65 U6.52 ; v1(34.08,23.29) 34.08,22.89 33.92,22.73 33.92,14.92 33.65,14.65 33.65,11.71 33.56,11.8 v1(33.56,11.83)
  Bottom Layer w0.158: 34.24,24.21 34.08,24.05 v1(34.08,23.29) ; v1(33.56,11.83) 33.56,11.81 32.94,11.2 32.94,5.49 31.32,3.86 29.38,3.86 29.22,3.7 v1(28.82,3.7)
BRD_D-: length 32.6
  Top Layer w0.158: v1(28.82,4.34) 28.42,4.34 28.26,4.17 27.22,4.17 ; 27.22,4.17 27.22,4.17 ; 27.22,4.17 26.73,4.17 arc(26.64,4.21) 26.6,4.3 26.6,4.55 arc(26.48,4.68) 26.35,4.55 26.35,4.3 arc(26.31,4.21) 26.22,4.17 25.37,4.17 24.72,4.82 24.72,7.61 24.77,7.65 U6.53 ; v1(33.45,23.29) 33.45,22.89 33.61,22.73 33.61,15.04 33.34,14.78 33.34,12.52 v1(33.18,12.35)
  Bottom Layer w0.158: v1(33.45,23.29) 32.52,24.21 32.52,24.24 ; v1(33.18,12.35) 33.02,12.2 33.02,11.71 32.63,11.33 32.63,5.62 31.19,4.17 29.38,4.17 29.22,4.34 v1(28.82,4.34)
BRD_PWR: length 75.2
  Inner2 w1.524: 30.61,23.26 30.61,24.5 29.85,25.27 ; 29.85,25.27 30.27,25.27 30.38,25.16 34.3,25.16 36.58,22.88 39.38,22.88 v1(40.9,24.4) ; 29.85,25.27 v1(29.33,25.79)
  Bottom Layer w0.254: 30.42,23.55 30.42,23.33 ; 30.42,23.55 30.52,23.55 30.58,23.49 ; 30.42,23.55 30.42,23.98 30.46,24.01 ; 30.42,23.33 v1(30.19,23.09) ; 30.42,23.33 30.58,23.49 ; 30.42,23.33 30.66,23.09 ; v1(30.73,23.75) 30.46,24.01 ; v1(30.73,23.75) 30.98,23.49 ; v1(30.73,23.75) 30.73,23.64 ; 30.46,24.01 30.19,24.29 ; 30.87,25.29 30.87,25.46 ; 30.87,25.29 30.6,25.03 ; 30.87,25.29 v1(31.12,25.54) ; 30.87,25.46 30.87,25.79 ; 30.87,25.46 30.52,25.11 ; v1(30.19,23.09) 30.19,24.29 ; v1(30.19,23.09) 30.66,23.09 ; 30.58,23.49 v1(30.98,23.09) ; 30.58,23.49 30.73,23.64 ; 30.52,25.11 30.6,25.03 ; 30.52,25.11 30.52,25.44 ; 30.6,25.03 30.46,24.88 ; 30.18,25.79 v1(29.33,25.79) 29.91,25.21 ; 30.18,25.79 30.52,25.79 ; 30.18,25.79 30.46,25.51 30.46,24.88 ; 30.98,23.49 31.37,23.1 ; 30.98,23.49 30.98,23.38 ; 30.87,25.79 31.37,25.79 ; 30.87,25.79 30.52,25.44 ; 30.87,25.79 30.52,25.79 ; 30.87,25.79 v1(31.12,25.54) ; 31.37,25.79 31.42,25.85 38.06,25.85 38.74,25.16 38.74,23.68 ; 31.37,25.79 v1(31.12,25.54) ; 30.46,24.88 30.14,24.57 USB3.1 30.19,24.29 ; 31.37,23.1 31.37,23.09 v1(30.98,23.09) ; 31.37,23.1 31.85,22.62 36.07,22.62 36.46,23.01 U29.1 38.74,23.07 ; 30.98,23.38 30.73,23.64 ; 30.98,23.38 v1(30.98,23.09) ; v1(30.98,23.09) 30.66,23.09 ; 30.52,25.44 30.52,25.79
  Bottom Layer w0.762: 38.74,23.89 39.25,24.4 v1(40.14,24.4) v1(40.9,24.4) v1(41.41,24.91) ; USB3.1 29.91,26.17 29.72,26.36 29.72,27.38 30.57,28.22 32.97,28.22 32.98,28.21 42.93,28.21 43.57,27.58 43.57,25.04 42.36,23.83 U28.1 ; 38.74,23.68 38.68,23.62 U29.1
BRD_PWR_EN: length 42.3
  Top Layer w0.152: U27.24 16.19,27.54 16.19,26.76 18.17,24.78 18.17,21.86 19.18,20.84 19.56,20.84 21.09,22.37 27.82,22.37 29.9,20.29 32.78,20.29 33.15,20.66 33.15,22.5 32.52,23.13
  Top Layer w0.254: v1(45.34,21.48) v1(41.15,21.48)
  Inner1 w0.254: v1(32.52,23.14) 32.89,22.77 39.87,22.77 v1(41.15,21.48)
  Bottom Layer w0.254: U29.4 40.58,20.91 v1(41.15,21.48) ; U28.4 45.03,21.48 v1(45.34,21.48)
CC1: length 10.2
  Top Layer w0.158: USB1.A5 8.38,13.34 8.69,13.64 8.69,13.67 v1(8.9,13.87)
  Top Layer w0.203: 16.72,14.39 16.26,14.39 arc(15.68,14.45) v1(15.12,14.62)
  Inner2 w0.203: v1(15.12,14.62) 9.64,14.62 v1(8.9,13.87)
CC2: length 12.4
  Top Layer w0.203: U11.28 arc(17.28,15.15) v1(16.64,15.26)
  Inner2 w0.203: v1(16.64,15.26) arc(15.64,14.29) 14.61,13.35 arc(13.18,12.35) 11.56,11.7 arc(10.28,11.44) v1(8.98,11.35)
  Bottom Layer w0.158: USB1.B5 8.39,11.84 arc(8.77,11.7) v1(8.98,11.35)
CTRL_TS_LED: length 21.7
  Top Layer w0.152: v1(4.2,30.62) 4.2,30.51 LED6.2 ; v1(17.41,26.69) 17.32,26.78 U27.27
  Bottom Layer w0.152: v1(17.41,26.69) 18.17,27.45 18.17,29.23 17.15,30.24 13.85,30.24 12.2,31.89 5.47,31.89 v1(4.2,30.62)
CTRL_UP_LED: length 22.1
  Top Layer w0.152: LED5.2 5.21,30.5 v1(4.07,31.64) ; U27.28 17.72,27.14 v1(18.17,26.69)
  Bottom Layer w0.152: v1(18.17,26.69) 18.55,27.07 18.55,29.35 17.41,30.5 14.23,30.5 12.32,32.4 4.83,32.4 v1(4.07,31.64)
DOWN_VCC_EN: length 17.1
  Top Layer w0.152: U27.13 15.72,33.01 v1(15.88,33.17)
  Top Layer w0.158: Q2.1 27.76,28.53 v1(26.04,30.24)
  Bottom Layer w0.152: v1(15.88,33.17) 16.13,33.42 20.96,33.42 24.14,30.24 v1(26.04,30.24)
HS_D+: length 41.7
  Top Layer w0.158: U6.63 28.77,7.68 arc(28.77,7.65) 28.79,7.63 arc(28.81,7.6) 28.81,7.57 28.81,7.26 arc(28.8,7.19) 28.76,7.13 arc(28.68,7.01) 28.65,6.86 v1(28.65,6.62) ; U27.20 14.04,28.81 arc(14.01,28.81) 13.99,28.83 arc(13.96,28.85) 13.93,28.85 13.72,28.85 arc(13.22,28.65) 13.02,28.15 13.02,27.23 arc(12.89,26.61) 12.54,26.09 12.31,25.85 arc(12.17,25.65) 12.13,25.42 12.13,21.61 arc(12.37,21.02) 12.96,20.77 17.62,20.77 arc(18.6,20.58) 19.42,20.03 20,19.45 arc(20.09,19.39) 20.2,19.37 arc(20.31,19.34) 20.4,19.28 v1(20.6,19.08)
  Bottom Layer w0.158: v1(28.65,6.62) 28.65,6.34 arc(28.67,6.23) 28.73,6.14 arc(28.79,6.05) 28.81,5.94 28.81,5.84 arc(28.63,5.4) 28.2,5.22 27.75,5.22 arc(27.66,5.26) 27.62,5.35 27.62,5.62 arc(27.49,5.75) 27.37,5.62 27.37,5.35 arc(27.33,5.26) 27.24,5.22 27.11,5.22 arc(27.02,5.26) 26.99,5.35 26.99,5.62 arc(26.86,5.75) 26.73,5.62 26.73,5.35 arc(26.69,5.26) 26.6,5.22 25.91,5.22 arc(25.32,5.47) 25.08,6.06 25.08,13.32 arc(24.89,14.29) 24.34,15.11 20.96,18.49 arc(20.9,18.58) 20.88,18.69 arc(20.86,18.79) 20.8,18.88 v1(20.6,19.08)
HS_D-: length 41.5
  Top Layer w0.158: U27.19 14.04,29.21 arc(14.01,29.2) 13.99,29.19 arc(13.96,29.17) 13.93,29.16 13.72,29.16 arc(13,28.87) 12.71,28.15 12.71,27.23 arc(12.61,26.73) 12.32,26.31 12.09,26.07 arc(11.89,25.77) 11.82,25.42 11.82,21.61 arc(12.15,20.8) 12.96,20.46 17.62,20.46 arc(18.48,20.29) 19.2,19.81 19.78,19.23 arc(19.84,19.14) 19.87,19.03 arc(19.89,18.93) 19.95,18.83 v1(20.15,18.63) ; v1(29.29,6.62) 29.29,6.86 arc(29.26,7.01) 29.18,7.13 arc(29.14,7.19) 29.12,7.26 29.12,7.57 arc(29.13,7.6) 29.15,7.63 arc(29.16,7.65) 29.17,7.68 U6.64
  Bottom Layer w0.158: v1(29.29,6.62) 29.29,6.34 arc(29.26,6.23) 29.2,6.14 arc(29.14,6.05) 29.12,5.94 29.12,5.84 arc(28.85,5.18) 28.2,4.91 25.91,4.91 arc(25.11,5.25) 24.77,6.06 24.77,13.32 arc(24.6,14.17) 24.12,14.89 20.74,18.27 arc(20.65,18.33) 20.54,18.35 arc(20.44,18.37) 20.35,18.43 v1(20.15,18.63)
HUB_CLK_IN: length 10
  Top Layer w0.254: 21.78,2.68 21.78,4.39 arc(21.76,4.52) X8.3 arc(22.34,4.9) 22.61,5.56 22.61,7.51 arc(22.35,8.14) 21.72,8.4 arc(21.27,8.58) 21.09,9.03 21.09,9.77 arc(21.27,10.22) 21.72,10.41 U6.45
HUB_CLK_OUT: length 7.4
  Top Layer w0.254: U6.44 21.57,10.81 arc(21.24,10.74) 20.96,10.56 20.72,10.32 arc(20.52,10.02) 20.45,9.67 20.45,7.3 arc(20.32,6.97) X8.1 arc(19.93,6.71) 19.81,6.66 C95.2
MCU_CLK_IN: length 5.7
  Top Layer w0.254: U27.2 20.88,28.81 arc(21.63,28.5) X7.3 arc(21.94,27.74) 21.94,27.74 C94.2
MCU_CLK_OUT: length 4.6
  Top Layer w0.254: U27.3 19.5,29.21 arc(20.02,29.42) X7.1 20.24,31.08 arc(20.48,31.66) C93.2
MUX_EN: length 40.6
  Top Layer w0.152: U27.10 16.92,31.98 17.25,32.31 17.73,32.31 18.32,32.91 v1(18.68,32.91)
  Top Layer w0.254: U2.2 44.51,15.96 arc(44.46,16.2) v1(44.33,16.4)
  Bottom Layer w0.158: v1(44.33,16.4) 44.31,16.42 arc(43.49,16.97) 42.51,17.16 35.57,17.16 34.94,17.79 34.94,20.44 33.12,22.26 29.71,22.26 28.84,23.13 28.84,27.45 28.01,28.27 22.42,28.27 20.33,30.37 20.33,31.77 19.18,32.91 v1(18.68,32.91)
RD_1V2: length 15.2
  Top Layer w0.254: U3.3 v1(38.51,4.21) 38.51,3.43 arc(38.44,3.26) C5.2 ; v1(41.83,10.32) 41.42,10.32 arc(41.19,10.27) U3.17 v1(41.01,11.11)
  Bottom Layer w0.254: v1(41.01,11.11) 41.56,11.11 arc(41.66,11.1) TP1.1 arc(41.81,10.94) 41.83,10.83 v1(41.83,10.32) arc(42.88,9.89) 43.31,8.84 43.31,8.27 arc(42.9,7.28) 41.92,6.88 41.53,6.88 arc(41.2,6.81) 40.92,6.62 v1(38.51,4.21)
RD_D+: length 10.8
  Top Layer w0.158: U3.32 36.37,5.99 arc(36.31,6.01) 36.25,6.04 arc(36.2,6.08) 36.14,6.09 34.14,6.09 arc(33.4,6.39) 33.1,7.13 33.1,9.66 arc(32.63,10.79) 31.5,11.25 30.8,11.25 arc(30.77,11.25) 30.75,11.23 arc(30.72,11.21) 30.69,11.21 U6.6
RD_D-: length 10.8
  Top Layer w0.158: U3.31 36.37,6.49 arc(36.31,6.48) 36.25,6.45 arc(36.2,6.41) 36.14,6.4 34.14,6.4 arc(33.62,6.61) 33.41,7.13 33.41,9.66 arc(32.85,11.01) 31.5,11.56 30.8,11.56 arc(30.77,11.57) 30.75,11.59 arc(30.72,11.6) 30.69,11.61 U6.7
RD_RX+: length 7.5
  Top Layer w0.158: U3.4 39.01,4.85 arc(39.02,4.79) 39.06,4.74 arc(39.09,4.69) 39.1,4.62 39.1,3.06 arc(38.81,2.37) 38.12,2.08 36.8,2.08 arc(36.71,2.11) 36.67,2.2 36.67,2.3 arc(36.55,2.43) 36.42,2.3 36.42,2.2 arc(36.38,2.11) 36.29,2.08 35.95,2.08 arc(35.49,2.17) C14.1
RD_RX-: length 7.4
  Top Layer w0.158: U3.5 39.51,4.85 arc(39.5,4.79) 39.46,4.74 arc(39.43,4.69) 39.41,4.62 39.41,3.06 arc(39.03,2.15) 38.12,1.77 35.95,1.77 arc(35.49,1.68) C15.1
RD_TX+: length 9.8
  Top Layer w0.158: C2.1 34,4.51 arc(33.67,4.29) 33.28,4.21 arc(32.83,4.4) 32.65,4.85 32.65,9.67 arc(32.32,10.44) 31.55,10.76 30.8,10.76 arc(30.48,10.77) U6.5
RD_TX-: length 9.8
  Top Layer w0.158: C3.1 34,3.6 arc(33.67,3.82) 33.28,3.9 arc(32.61,4.18) 32.34,4.85 32.34,9.67 arc(32.11,10.22) 31.55,10.45 30.8,10.45 arc(30.48,10.44) U6.4
SEL0: length 34
  Top Layer w0.152: U27.11 16.52,32.15 17.15,32.78 v1(17.53,32.78)
  Top Layer w0.158: U2.16 37.51,15.87 arc(37.47,16.09) 37.34,16.27 arc(37.2,16.37) 37.04,16.4 v1(36.33,16.4)
  Bottom Layer w0.158: v1(17.53,32.78) 17.88,32.44 18.89,32.44 20.07,31.26 20.07,29.99 22.1,27.96 27.69,27.96 28.45,27.19 28.45,22.88 29.33,22 33.01,22 34.68,20.33 34.68,17.67 35.95,16.4 v1(36.33,16.4)
SEL1: length 32.5
  Top Layer w0.158: v1(35.31,16.15) 35.42,16.03 arc(35.72,15.84) 36.07,15.77 36.69,15.77 arc(36.86,15.73) U2.17 ; v1(16.39,32.78) 16.12,32.51 U27.12
  Bottom Layer w0.158: v1(35.31,16.15) 34.42,17.03 34.42,20.07 32.76,21.73 27.82,21.73 26.42,23.13 26.42,23.51 25.03,24.91 23.88,24.91 19.81,28.98 19.81,31.16 19.2,31.77 17.02,31.77 16.39,32.4 v1(16.39,32.78)
SER_D+: length 31.6
  Top Layer w0.158: v1(31.44,12.29) 31.33,12.41 U6.9
  Bottom Layer w0.158: v1(31.44,12.29) 31.73,12.29 arc(31.83,12.31) 31.92,12.37 arc(32.01,12.43) 32.12,12.45 32.16,12.45 arc(32.72,12.69) 32.95,13.25 32.95,19.32 arc(32.6,20.17) 31.76,20.52 21.72,20.52 arc(20.86,20.88) 20.51,21.73 20.51,24.27 arc(19.97,25.57) 18.68,26.11 16.64,26.11 arc(16.21,26.13) 15.78,26.22
SER_D-: length 31.6
  Top Layer w0.158: U6.10 31.33,12.81 v1(31.44,12.93)
  Bottom Layer w0.158: v1(31.44,12.93) 31.73,12.93 arc(31.83,12.91) 31.92,12.84 arc(32.01,12.78) 32.12,12.76 32.16,12.76 arc(32.5,12.9) 32.65,13.25 32.65,13.64 arc(32.61,13.73) 32.52,13.77 32.14,13.77 arc(32.01,13.89) 32.14,14.02 32.52,14.02 arc(32.61,14.06) 32.65,14.15 32.65,19.32 arc(32.38,19.95) 31.76,20.21 21.72,20.21 arc(20.65,20.66) 20.2,21.73 20.2,24.27 arc(19.75,25.35) 18.68,25.8 16.64,25.8 arc(16.21,25.78) 15.78,25.71
TF_1V2: length 65.5
  Top Layer w0.254: v1(21.22,12.36) 21.26,12.41 U6.40 ; U6.13 31.1,14.01 arc(31.11,14) v1(31.12,13.99) ; 25.18,16.32 v1(25.18,16.9) C23.2 ; v1(33.97,10.04) 34.47,10.04 arc(34.53,10.01) 34.55,9.96 ; U6.3 31.54,10.01 arc(31.51,9.97) v1(31.46,9.98) ; U6.49 23.17,7.46 arc(23.19,7.4) v1(23.25,7.38) 23.72,6.91 C26.2 ; U6.58 v1(26.77,7.49) 26.77,7.07 arc(26.82,6.96) C20.1
  Inner2 w0.254: v1(33.97,10.04) 31.52,10.04 arc(31.48,10.02) v1(31.46,9.98)
  Inner2 w0.762: v1(21.22,12.36) 21.84,12.99 arc(22.67,13.54) 23.64,13.73 23.75,13.73 24.23,14.21 ; 25.28,8.02 25.28,12.11 arc(25.09,13.08) 24.53,13.91 24.23,14.21 ; 25.28,8.02 25.5,8.02 arc(26.18,7.88) v1(26.77,7.49) v1(29.89,7.49) v1(30.61,7.49) arc(31.21,7.74) 31.46,8.34 v1(31.46,9.98) arc(30.68,10.31) 30.36,11.09 30.36,13.99 v1(31.12,13.99) 31.12,16.24 arc(30.93,16.71) v1(30.45,16.91) v1(29.72,16.91) arc(29.46,16.28) 28.84,16.02 26.06,16.02 arc(25.44,16.28) v1(25.18,16.9) 25.18,16.21 arc(24.99,15.24) 24.44,14.42 24.23,14.21 ; 25.28,8.02 arc(24.58,7.55) 23.75,7.38 v1(23.25,7.38)
  Bottom Layer w0.254: 22.32,13.22 22.08,13.22 v1(21.22,12.36) ; v1(29.89,7.49) 30.16,7.22 arc(30.31,7) TP2.1
  Bottom Layer w0.508: v1(26.77,7.49) v1(29.89,7.49) v1(30.61,7.49) ; 30.45,14.66 v1(30.45,16.91) v1(29.72,16.91) ; 30.45,14.66 30.45,10.99 arc(30.75,10.28) v1(31.46,9.98) ; 30.45,14.66 arc(30.65,14.18) v1(31.12,13.99)
TF_CLK: length 7.6
  Top Layer w0.158: U2.7 42.01,16.33 arc(41.92,16.79) 41.66,17.19 41.07,17.77 arc(40.94,17.97) 40.89,18.2 40.89,18.52 arc(40.86,18.61) 40.77,18.64 40.29,18.64 arc(40.16,18.77) 40.29,18.9 41.5,18.9 arc(41.62,19.02) 41.5,19.15 41.02,19.15 arc(40.93,19.19) 40.89,19.28 40.89,20.25 arc(40.89,20.26) CARD1.5
TF_CMD: length 7.6
  Top Layer w0.158: U2.8 41.51,15.64 arc(41.32,16.61) 40.77,17.44 40.64,17.57 arc(40.36,17.75) 40.03,17.82 39.12,17.82 arc(38.81,17.95) 38.69,18.25 38.69,18.7 arc(38.72,18.79) 38.81,18.83 39.24,18.83 arc(39.37,18.95) 39.24,19.08 38.81,19.08 arc(38.72,19.12) 38.69,19.21 CARD1.3
TF_DAT0: length 7.5
  Top Layer w0.158: U2.6 42.51,16.8 arc(42.58,17.12) 42.76,17.4 42.8,17.44 arc(43.01,17.76) 43.09,18.13 43.09,18.42 arc(43.05,18.51) 42.96,18.54 42.44,18.54 arc(42.31,18.67) 42.44,18.8 43.73,18.8 arc(43.86,18.93) 43.73,19.05 43.21,19.05 arc(43.12,19.09) 43.09,19.18 CARD1.7
TF_DAT1: length 7.6
  Top Layer w0.158: U2.5 43.01,16.12 arc(43.22,16.64) 43.74,16.85 arc(44.14,17.02) 44.31,17.42 44.31,18.07 arc(44.34,18.16) 44.43,18.2 44.9,18.2 arc(45.03,18.33) 44.9,18.45 44.43,18.45 arc(44.31,18.58) 44.43,18.71 44.9,18.71 arc(45.03,18.83) 44.9,18.96 44.43,18.96 arc(44.34,19) 44.31,19.09 44.31,19.76 arc(44.28,19.88) 44.22,19.98
TF_DAT2: length 7.5
  Top Layer w0.158: CARD1.1 36.49,17.53 arc(36.74,16.93) 37.34,16.68 39.38,16.68 arc(39.83,16.49) 40.01,16.04 U2.11
TF_DAT3: length 7.7
  Top Layer w0.158: 40.51,15.63 40.51,16.3 arc(40.22,17.01) 39.5,17.31 38.1,17.31 arc(37.74,17.46) 37.59,17.83 37.59,18.53 arc(37.55,18.62) 37.46,18.66 37.21,18.66 arc(37.08,18.78) 37.21,18.91 37.46,18.91 arc(37.55,18.95) 37.59,19.04 CARD1.2
TF_VCC: length 19.7
  Top Layer w0.254: 28.45,33.04 31.62,33.04 34.55,30.12 35.19,30.12 38.49,26.81 38.49,22.88 39.79,21.58 CARD1.4
TF_VCC_EN: length 1.2
  Top Layer w0.158: Q4.1 26.68,30.74 v1(26.42,31)
TS_CLK: length 20.1
  Top Layer w0.158: U2.36 44.01,11.84 arc(44.09,11.43) 44.32,11.09 44.98,10.44 arc(45.8,9.89) 46.77,9.69 51.78,9.69 arc(52.75,9.89) 53.58,10.44 54.07,10.93 arc(54.43,11.17) 54.86,11.26 55.19,11.26 arc(55.28,11.3) 55.32,11.39 55.32,11.56 arc(55.45,11.69) 55.58,11.56 55.58,10.96 arc(55.7,10.83) 55.83,10.96 55.83,11.56 arc(55.96,11.69) 56.08,11.56 56.08,10.96 arc(56.21,10.83) 56.34,10.96 56.34,11.13 arc(56.37,11.22) 56.46,11.26 v1(56.77,11.26)
  Bottom Layer w0.158: U1.5 v1(56.77,11.26)
TS_CMD: length 20
  Top Layer w0.158: v1(56.77,9.06) 51.96,9.06 arc(51.87,9.02) 51.83,8.93 51.83,8.76 arc(51.7,8.63) 51.57,8.76 51.57,8.93 arc(51.45,9.06) 51.32,8.93 51.32,8.76 arc(51.19,8.63) 51.07,8.76 51.07,8.93 arc(50.94,9.06) 50.81,8.93 50.81,8.76 arc(50.69,8.63) 50.56,8.76 50.56,8.93 arc(50.43,9.06) 50.3,8.93 50.3,8.76 arc(50.18,8.63) 50.05,8.76 50.05,8.93 arc(50.01,9.02) 49.92,9.06 46.77,9.06 arc(45.8,9.25) 44.98,9.8 44.07,10.71 arc(43.66,11.33) 43.51,12.05 U2.35
  Bottom Layer w0.158: 59.26,9.06 v1(56.77,9.06)
TS_DAT0: length 20.1
  Top Layer w0.158: U2.37 44.51,11.85 arc(44.57,11.56) 44.74,11.31 45.09,10.96 arc(45.65,10.59) 46.31,10.45 48.52,10.45 arc(48.61,10.49) 48.64,10.58 48.64,10.99 arc(48.77,11.12) 48.9,10.99 48.9,10.58 arc(49.03,10.45) 49.15,10.58 49.15,10.99 arc(49.28,11.12) 49.41,10.99 49.41,10.58 arc(49.53,10.45) 49.66,10.58 49.66,10.99 arc(49.79,11.12) 49.91,10.99 49.91,10.58 arc(49.95,10.49) 50.04,10.45 51.78,10.45 arc(52.75,10.65) 53.58,11.2 55.18,12.8 arc(55.91,13.29) v1(56.77,13.46)
  Bottom Layer w0.158: U1.7 v1(56.77,13.46)
TS_DAT1: length 20.1
  Top Layer w0.158: U2.38 45.01,11.85 arc(45.12,11.58) 45.39,11.47 46.58,11.47 arc(47.08,11.57) 47.5,11.85 49.46,13.81 arc(50.29,14.37) 51.26,14.56 51.54,14.56 arc(51.63,14.52) 51.67,14.43 51.67,13.88 arc(51.8,13.75) 51.92,13.88 51.92,14.43 arc(52.05,14.56) 52.18,14.43 52.18,13.88 arc(52.3,13.75) 52.43,13.88 52.43,14.43 arc(52.56,14.56) 52.69,14.43 52.69,13.88 arc(52.81,13.75) 52.94,13.88 52.94,14.43 arc(52.98,14.52) 53.07,14.56 v1(56.77,14.56)
  Bottom Layer w0.158: U1.8 v1(56.77,14.56)
TS_DAT2: length 20.1
  Top Layer w0.158: U2.33 42.51,10.9 arc(42.71,9.93) 43.26,9.11 44.76,7.6 arc(45.59,7.05) 46.56,6.86 v1(56.77,6.86)
  Bottom Layer w0.158: U1.1 v1(56.77,6.86)
TS_DAT3: length 20.1
  Top Layer w0.158: U2.34 43.01,11.42 arc(43.21,10.45) 43.76,9.62 44.68,8.7 arc(45.5,8.15) 46.47,7.96 48.69,7.96 arc(48.78,7.92) 48.81,7.83 48.81,7.69 arc(48.94,7.56) 49.07,7.69 49.07,8.22 arc(49.19,8.35) 49.32,8.22 49.32,8.08 arc(49.36,7.99) 49.45,7.96 v1(56.77,7.96)
  Bottom Layer w0.158: U1.2 v1(56.77,7.96)
TS_RXD: length 18.9
  Bottom Layer w0.254: H2.2 4.58,28.08 6.48,29.99 12.41,29.99 13.28,29.12 13.28,28.72
TS_TXD: length 22.6
  Bottom Layer w0.254: 13.78,28.72 13.78,29.42 12.2,31 5.59,31 2.04,27.45 H2.1
TS_VCC: length 52.5
  Top Layer w0.254: v1(24.9,29.48) 23.75,30.63 Q3.2
  Bottom Layer w0.254: U1.4 59.09,10.18 51.44,10.18 49.08,12.54 49.08,13.43 48.9,13.61 47.12,13.61 45.98,14.75 45.98,17.03 46.62,17.67 46.62,26.56 43.95,29.23 25.15,29.23 v1(24.9,29.48)
UP_CHO: length 36.4
  Top Layer w0.158: U27.7 18.55,30.84 v1(18.55,31.26)
  Top Layer w0.254: U3.29 v1(35.82,7.49)
  Bottom Layer w0.158: v1(18.55,31.26) 18.55,29.86 18.93,29.48 18.93,27.7 21.34,25.29 22.99,25.29 26.82,21.46 32.66,21.46 33.32,20.8 arc(33.86,20.01) 34.04,19.07 34.04,16.94 arc(34.14,16.44) 34.42,16.02 arc(34.89,15.32) 35.06,14.49 35.06,9.31 arc(35.25,8.34) 35.8,7.51 v1(35.82,7.49)
UP_CLK: length 2.2
  Top Layer w0.158: U2.27 U3.20
UP_CMD: length 2.2
  Top Layer w0.158: U2.26 U3.21
UP_D+: length 20.4
  Top Layer w0.158: USB1.A6 8,12.84 arc(8.06,12.83) 8.11,12.79 arc(8.16,12.76) 8.23,12.75 8.37,12.75 arc(8.6,12.77) 8.81,12.86 ; 8.81,12.86 8.78,12.86 v1(8.75,12.89) arc(8.8,12.9) 8.81,12.86 ; 8.81,12.86 8.77,12.81 v1(8.77,12.27) ; U6.37 21.57,13.61 arc(21.22,13.64) v1(20.86,13.62)
  Inner1 w0.135: v1(8.75,12.89) arc(9.21,13.46) 9.51,14.12 arc(9.89,14.78) 10.5,15.23 arc(10.71,15.3) 10.93,15.33 arc(11.83,15.4) 12.71,15.58 arc(12.9,15.7) v1(13,15.89)
  Bottom Layer w0.158: USB1.B6 8,12.34 arc(8.06,12.35) 8.11,12.39 arc(8.16,12.42) 8.23,12.44 8.37,12.44 arc(8.59,12.39) v1(8.77,12.27) ; 13.37,15.39 arc(13.83,14.53) 14.62,13.96 ; 13.37,15.4 arc(13.31,15.53) 13.21,15.64 arc(13.09,15.75) v1(13,15.89) ; 14.62,13.95 arc(15.26,13.76) 15.93,13.7 arc(16.5,13.71) 17.08,13.71 18.25,13.7 arc(18.41,13.67) 18.54,13.58 18.7,13.43 arc(18.78,13.37) 18.88,13.35 19.56,13.35 arc(19.87,13.37) 20.17,13.4 arc(20.53,13.46) v1(20.86,13.62)
UP_D-: length 21.5
  Top Layer w0.158: U6.36 21.57,14.01 arc(21.43,14.04) v1(21.31,14.13) ; v1(9.4,12.91) v1(9.4,12.27) 9.18,12.05 arc(8.8,11.8) 8.39,11.99 arc(7.77,12.34) 7.05,12.34
  Inner1 w0.135: v1(9.4,12.91) 9.4,13.04 arc(9.43,13.19) 9.49,13.33 arc(9.67,13.67) 9.81,14.02 arc(9.95,14.34) 10.17,14.62 arc(10.2,14.65) 10.23,14.68 arc(10.42,14.83) 10.63,14.95 arc(10.78,15) 10.93,15.02 arc(11.86,15.09) 12.76,15.3 arc(12.77,15.3) 12.79,15.3 arc(12.83,15.32) 12.87,15.33 arc(13.11,15.42) 13.34,15.51 arc(13.54,15.66) v1(13.63,15.89)
  Bottom Layer w0.158: v1(13.63,15.89) 13.63,15.59 arc(13.65,15.53) 13.67,15.47 arc(13.67,15.46) 13.68,15.44 arc(13.83,15.06) 14.08,14.71 14.21,14.58 arc(14.46,14.39) 14.74,14.25 arc(14.76,14.23) 14.79,14.22 arc(15.29,14.07) 15.8,14.02 16.04,14.02 arc(16.56,14.02) 17.08,14.02 ; v1(9.4,12.91) 9.18,13.13 arc(8.8,13.38) 8.39,13.19 arc(7.77,12.84) 7.05,12.84 ; 17.08,14.02 18.08,14.02 arc(18.39,14.08) 18.66,14.26 arc(18.78,14.34) 18.93,14.37 19.56,14.37 arc(19.88,14.33) U8.1 arc(20.73,14.14) v1(21.31,14.13)
UP_DAT0: length 2.2
  Top Layer w0.158: U2.28 U3.19
UP_DAT1: length 2.2
  Top Layer w0.158: U2.29 U3.18
UP_DAT2: length 2.2
  Top Layer w0.158: U2.24 U3.23
UP_DAT3: length 2.2
  Top Layer w0.158: U2.25 U3.22
UP_LED: length 50
  Top Layer w0.158: LED9.2 5.72,27.44 v1(5.72,26.69) ; U3.14 v1(42.24,8.49)
  Inner1 w0.254: v1(33.53,5.62) 33.52,5.62 v1(30.61,8.53)
  Bottom Layer w0.158: v1(42.24,8.49) 39.63,8.49 arc(38.66,8.3) 37.84,7.75 36.96,6.88 arc(36.4,6.5) 35.74,6.37 34.28,6.37 v1(33.53,5.62) ; v1(30.61,8.53) 30.61,8.65 29.99,9.27 arc(28.82,10.61) 27.82,12.08 arc(27.12,13.56) 26.68,15.13 arc(26.47,15.91) 26.17,16.65 23.74,19.08 arc(22.91,19.64) 21.94,19.83 11.73,19.83 arc(10.75,20.02) 9.93,20.57 6.46,24.04 arc(5.91,24.86) 5.72,25.83 v1(5.72,26.69)
UP_RX1+: length 10.6
  Top Layer w0.158: 16.72,12.39 16.25,12.39 arc(16.22,12.38) 16.19,12.37 arc(16.17,12.35) 16.14,12.34 15.87,12.34 arc(15.66,12.39) v1(15.48,12.51)
  Bottom Layer w0.158: 12.83,13.5 11.94,13.5 arc(11.88,13.51) 11.83,13.54 arc(11.78,13.58) 11.72,13.59 U7.6 U7.5 arc(10.16,13.58) 9.95,13.67 arc(9.88,13.76) 9.84,13.86 arc(9.84,13.89) 9.84,13.91 arc(9.5,14.48) 8.88,14.68 arc(8.7,14.67) 8.52,14.66 arc(8.3,14.67) 8.07,14.7 arc(7.57,14.78) USB1.B11 ; v1(15.48,12.51) arc(14.91,12.72) 14.43,13.08 arc(13.95,13.39) 13.38,13.5 arc(13.12,13.49) 12.87,13.49 arc(12.86,13.49) 12.86,13.49 arc(12.85,13.49) 12.84,13.49
UP_RX1-: length 10.8
  Top Layer w0.158: 16.72,11.99 16.25,11.99 arc(16.22,12) 16.19,12.01 arc(16.17,12.03) 16.14,12.03 15.87,12.03 arc(15.66,11.99) v1(15.48,11.87)
  Bottom Layer w0.158: 12.83,13.19 11.94,13.19 arc(11.88,13.17) 11.83,13.14 arc(11.78,13.1) 11.72,13.09 U7.7 U7.4 arc(10.07,13.19) 9.78,13.35 arc(9.6,13.58) 9.53,13.86 arc(9.31,14.23) 8.9,14.37 arc(7.98,14.34) USB1.B10 ; v1(15.48,11.87) arc(15.21,11.93) 14.99,12.08 14.21,12.86 arc(13.83,13.11) 13.39,13.19 arc(13.13,13.18) 12.87,13.18
